# Altium project Smart Bike Theft Tracker (GPS + LoRaWAN, Ultra-Low Power).PrjPcb
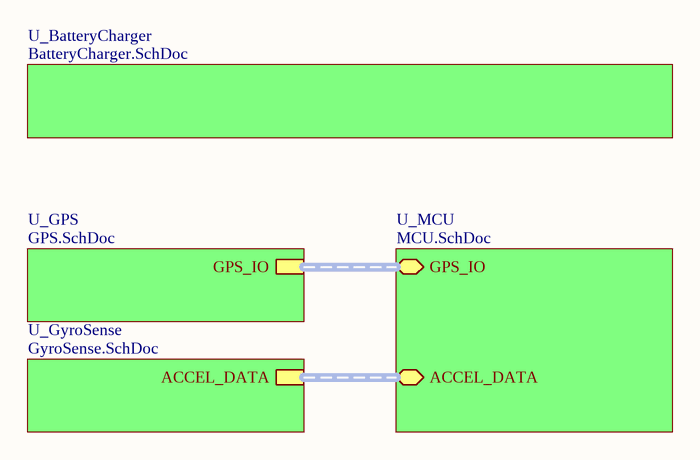
[diagram p0: Top.SchDoc]
5 sheets, 43 parts. Net scope: hierarchical (ports join the sheet entries above them; power ports are global).
Board file: Smart Bike Theft Tracker.PcbDoc
Sheets:
  Top.SchDoc
    U_GPS = GPS.SchDoc
    U_GyroSense = GyroSense.SchDoc
    U_MCU = MCU.SchDoc
    U_BatteryCharger = BatteryCharger.SchDoc

## Sheet Top.SchDoc
size A

### Sub-sheets
U_BatteryCharger = BatteryCharger.SchDoc: no entries
U_GPS = GPS.SchDoc: GPS_IO (harness GPS_IO)
U_GyroSense = GyroSense.SchDoc: ACCEL_DATA (harness ACCEL)
U_MCU = MCU.SchDoc: GPS_IO (bidir, harness GPS_IO), ACCEL_DATA (bidir, harness ACCEL)

### Buses and harness runs
harness sheet U_GPS/GPS_IO = sheet U_MCU/GPS_IO
harness sheet U_GyroSense/ACCEL_DATA = sheet U_MCU/ACCEL_DATA

## Sheet GPS.SchDoc
size A
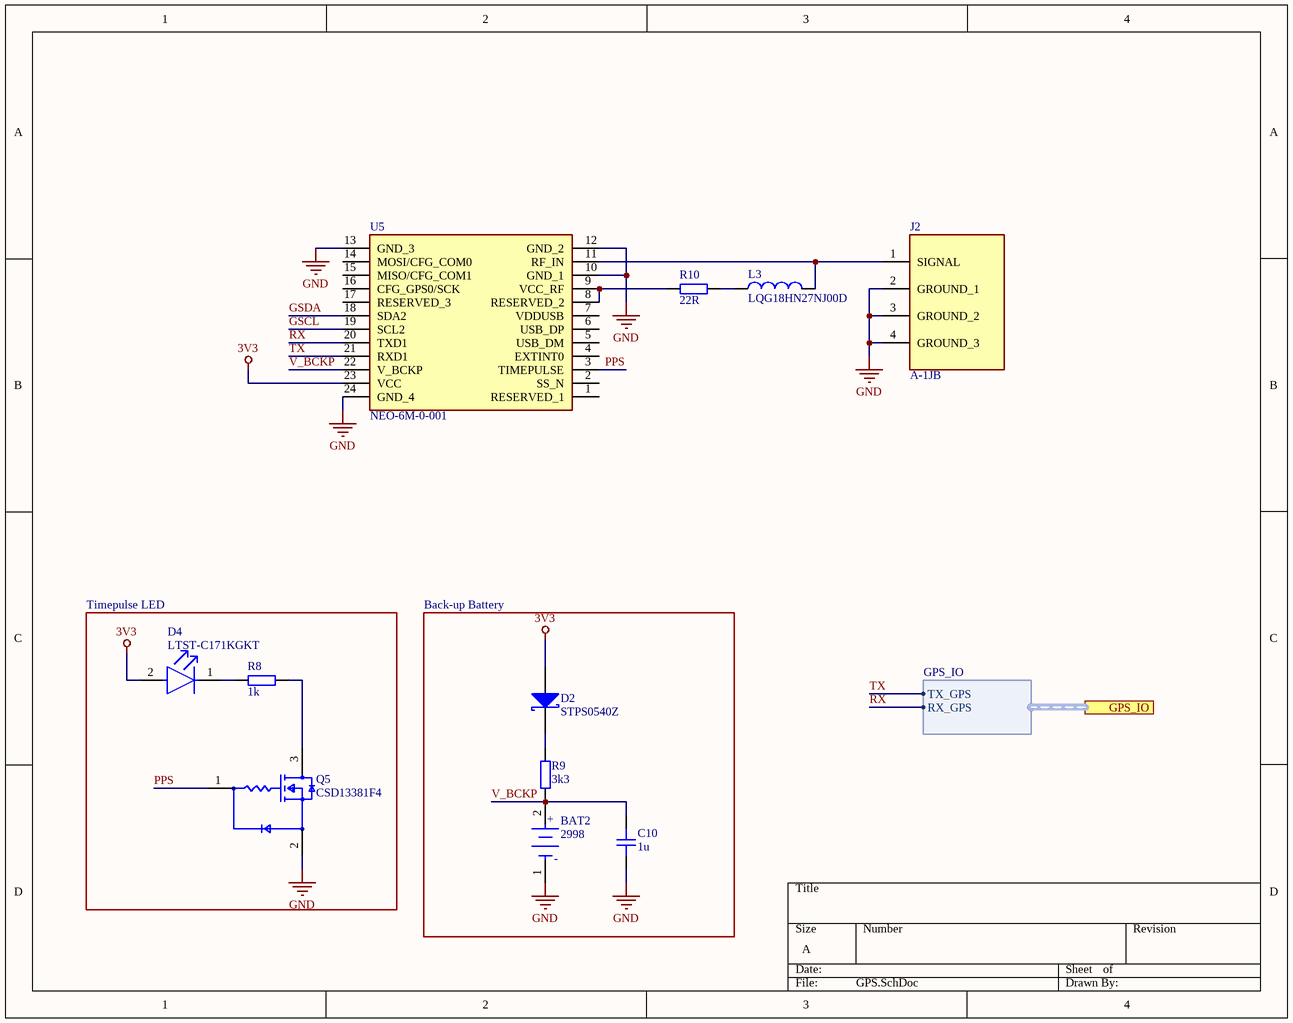
[diagram p1: GPS.SchDoc]

### Parts
BAT2  2998  [BAT_2998TR]
C10  1u  [CAP_0603]
D2  STPS0540Z  [STM-SOD-123-2_V]
D4  LTST-C171KGKT  [FP-LTST-C171KGKT-MFG]
J2  A-1JB  [A1JB]
L3  LQG18HN27NJ00D  [CAP_0603]
Q5  CSD13381F4  [FP-CSD13381F4-MFG]
R8  1k  [RES_0603]
R9  3k3  [RES_0603]
R10  22R  [RES_0603]
U5  NEO-6M-0-001  [NEO6M0001]

### Blocks framed on the sheet
Timepulse LED: D4 Q5 R8
Back-up Battery: BAT2 C10 D2 R9

### Ports
GPS_IO (harness GPS_IO)

### Harnesses
GPS_IO: TX_GPS, RX_GPS

### Nets
3V3: D2.1(A) D4.2(A) U5.23(VCC)
GND: BAT2.1(C) C10.1 J2.2(GROUND_1) J2.3(GROUND_2) J2.4(GROUND_3) Q5.2(S) U5.10(GND_1) U5.12(GND_2) U5.13(GND_3) U5.24(GND_4)
GSCL: U5.19(SCL2)
GSDA: U5.18(SDA2)
PPS: Q5.1(G) U5.3(TIMEPULSE)
RX: U5.20(TXD1) ; port GPS_IO.RX_GPS
TX: U5.21(RXD1) ; port GPS_IO.TX_GPS
V_BCKP: BAT2.2(A) C10.2 R9.1 U5.22(V_BCKP)
NetD2_2: D2.2(K) R9.2
NetD4_1: D4.1(C) R8.1
NetJ2_1: J2.1(SIGNAL) L3.2 U5.11(RF_IN)
NetL3_1: L3.1 R10.2
NetQ5_3: Q5.3(D) R8.2
NetR10_1: R10.1 U5.8(RESERVED_2) U5.9(VCC_RF)

Not connected (* = marked no-connect by the designer): U5 1(RESERVED_1) 2(SS_N) 4(EXTINT0) 5(USB_DM) 6(USB_DP) 7(VDDUSB) 14(MOSI/CFG_COM0) 15(MISO/CFG_COM1) 16(CFG_GPS0/SCK) 17(RESERVED_3)

### Notes on the sheet
- (in symbol 2998) +; -

### Library data of the parts
BAT2 = 2998: BATTERY RETAINER COIN 6.8MM SMD; Number of Batteries: 1; Package Quantity: 100; Mount: Surface Mount; Case/Package: SMD/SMT; Number of Cells: 1; REACH SVHC: No SVHC; Height: 2.9mm; Contact Material: Bronze; Material: Bronze; Lead Free: Lead Free; Termination: SMD/SMT; Color: Silver
C10 = CAP_0603: Ceramic Capacitor SMD 0603; Manufacturer: *; Manufacturer Part Number: *; Distributor Link: *; LCSC: *; Rating: *; Dielectric: *
D2 = CMP-2000-07170-1: Schottky Rectifier, 0.5 A, 40 V, 2-Pin SOP (SOD-123), RoHS, Tape and Reel; Manufacturer: STMicroelectronics; SVHC: NoSVHC(15-Jun-2015); Forward Current If(AV): 500mA; Forward Voltage VF Max: 500mV; Repetitive Reverse Voltage Vrrm Max: 40V; No. of Pins: 2Pins; Forward Surge Current Ifsm Max: 5.5A; Diode Configuration: Single; Packaging: CutTape; Datasheet Version: 01/2002; Package Reference: SOD-123-2; Package Description: 2-Pin Small Outline Diode, Body 2.7 x 1.55 mm; Manufacturer URL: http://www.st.com/; Mounting Technology: SurfaceMount; Product Range: -; Operating Temperature Max: 150°C; Diode Case Style: SOD-123; Diode Type: Schottky; Datasheet URL: http://www.st.com/content/ccc/resource/technical/document/datasheet/group1/0f/03/9b/7c/50/58/48/d7/CD00001852/files/CD00001852.pdf/jcr:content/translations/en.CD00001852.pdf
D4 = CMP-22017-000037-1: LED GREEN CLEAR SMD; Number of LEDs: 1; Viewing Angle: 130°; Lens Style: Rectangular; Dominant Wavelength: 571nm; Test Current: 20mA; Luminous Intensity: 35mcd; Power Rating: 75mW; Forward Voltage: 2.4V; Forward Current: 30mA; Reverse Voltage: 5V; Lens Color: Colorless; Wavelength: 574nm; Height: 0.8mm; Illumination Color: Green; Length: 2mm; Case/Package: 0805; Number of Pins: 2; Number of Elements: 1; Package Quantity: 1; Depth: 1.25mm; Lens Transparency: Clear; Width: 1.25mm; Color: Green; Radiation Hardening: No; Mount: Surface Mount; Packaging: Tape and Reel; Case Code (Metric): 2012; Lead Free: Lead Free; Max Operating Temperature: 85°C; Min Operating Temperature: -55°C; Case Code (Imperial): 0805; Power Dissipation: 75mW
J2 = A-1JB: U.FL (UMCC), AMC Connector Jack, Male Pin 50 Ohms Surface Mount Solder; Manufacturer_Name: Amphenol RF; Geometry.Height: 1.35mm; Manufacturer_Part_Number: A-1JB; Mouser Part Number: 523-A-1JB; Mouser Price/Stock: https://www.mouser.co.uk/ProductDetail/Amphenol-RF/A-1JB?qs=ncxkyCpAYDBidtvTkuzl1Q%3D%3D; Arrow Part Number: A-1JB; Arrow Price/Stock: https://www.arrow.com/en/products/a-1jb/amphenol-rf?utm_currency=USD&region=europe; Datasheet Link: https://s3-us-west-2.amazonaws.com/catsy.582/ca-1jb.pdf
L3 = LQG18HN27NJ00D: Ind RF Chip Multi-Layer 27nH 5% 100MHz 12Q-Factor Air 300mA 0603 Paper T/R; Package: None; Price: None; Value: *; MP: LQG18HN27NJ00D; Availability: Unavailable
Q5 = CMP-04962-000059-1: MOSFET N-CH 12V 2.1A 3PICOSTAR; Rise Time: 1.5ns; Gate to Source Voltage (Vgs): 8V; Max Power Dissipation: 500mW; Number of Elements: 1; Element Configuration: Single; Turn-Off Delay Time: 11ns; Turn-On Delay Time: 3.7ns; Drain to Source Resistance: 180mR; Input Capacitance: 200pF; Fall Time: 3.8ns; Number of Pins: 3; Drain to Source Breakdown Voltage: 12V; Package Quantity: 3000; Power Dissipation: 500mW; RoHS Compliant: Yes; Case/Package: QFN; Max Operating Temperature: 150°C; Mount: Surface Mount; Continuous Drain Current (ID): 2.1A; Drain to Source Voltage (Vdss): 12V; Number of Channels: 1; Rds On Max: 180mR; Packaging: Tape and Reel; Lead Free: Lead Free; Min Operating Temperature: -55°C
R8-R10 = RES_0603: Resistor SMD 0603; Manufacturer: *; Manufacturer Part Number: *; Distributor Link: *; LCSC: *
U5 = NEO-6M-0-001: GPS Module; Manufacturer_Name: u-blox; Geometry.Height: 2.6mm; Manufacturer_Part_Number: NEO-6M-0-001; Mouser Part Number: *; Mouser Price/Stock: *; Arrow Part Number: *; Arrow Price/Stock: *; Datasheet Link: https://www.u-blox.com/sites/default/files/products/documents/NEO-6_DataSheet_%28GPS.G6-HW-09005%29.pdf

## Sheet GyroSense.SchDoc
size A
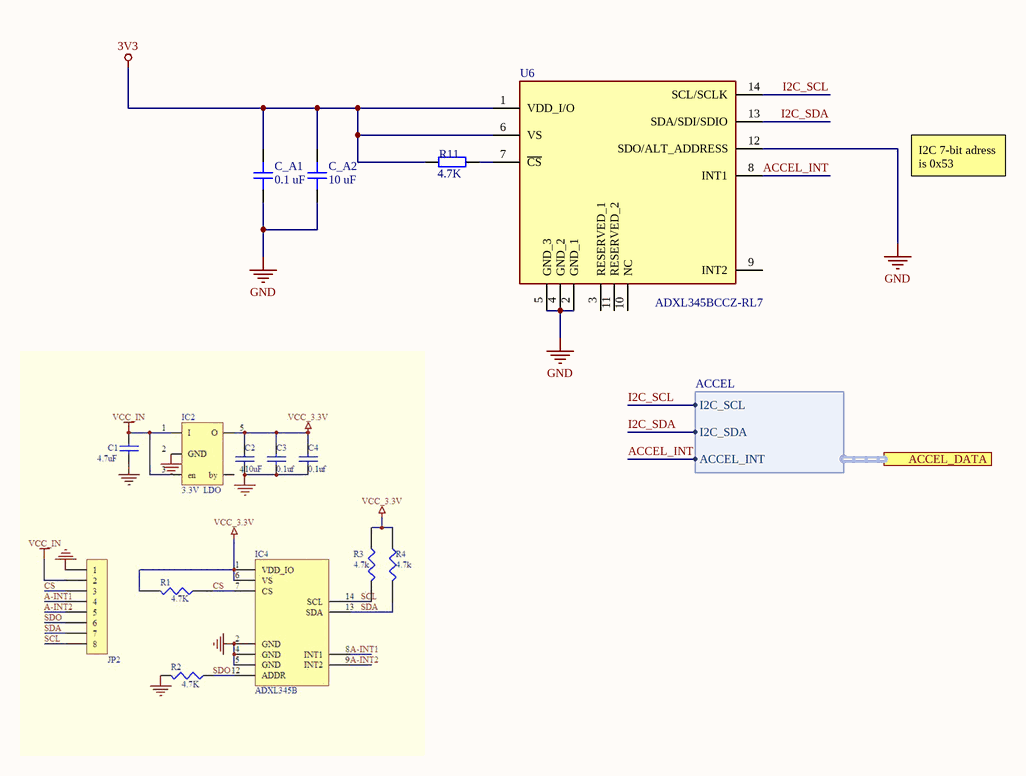
[diagram p2: GyroSense.SchDoc]

### Parts
C_A1  0.1 uF  [CAP_0603]
C_A2  10 uF  [CAP_0603]
R11  4.7K  [RES_0603]
U6  ADXL345BCCZ-RL7  [ADXL345BCCZRL7]

### Ports
ACCEL_DATA (harness ACCEL)

### Harnesses
ACCEL: I2C_SCL, ACCEL_INT, I2C_SDA

### Nets
3V3: C_A1.2 C_A2.2 R11.1 U6.1(VDD_I/O) U6.6(VS)
GND: C_A1.1 C_A2.1 U6.2(GND_1) U6.4(GND_2) U6.5(GND_3) U6.12(SDO/ALT_ADDRESS)
ACCEL_INT: U6.8(INT1) ; port ACCEL_DATA.ACCEL_INT
I2C_SCL: U6.14(SCL/SCLK) ; port ACCEL_DATA.I2C_SCL
I2C_SDA: U6.13(SDA/SDI/SDIO) ; port ACCEL_DATA.I2C_SDA
NetR11_2: R11.2 U6.7(~{CS})

Not connected (* = marked no-connect by the designer): U6 3(RESERVED_1) 9(INT2) 10(NC) 11(RESERVED_2)

### Notes on the sheet
- I2C 7-bit adress is 0x53

### Library data of the parts
C_A1 C_A2 = CAP_0603: Capacitor SMD 0603; Manufacturer: *; Manufacturer Part Number: *; Distributor Link: *; LCSC: *; Rating: *; Dielectric: *
R11 = RES_0603: Resistor SMD 0603; Manufacturer: *; Manufacturer Part Number: *; Distributor Link: *; LCSC: *
U6 = ADXL345BCCZ-RL7: ADXL345BCCZ-RL7 Analog Devices, 3-Axis Accelerometer, I2C, SPI, 14-Pin LGA 0.3 V to +3.9 V 40C to +105C; Geometry.Height: 1mm; Manufacturer_Name: Analog Devices; Manufacturer_Part_Number: ADXL345BCCZ-RL7; Mouser Part Number: 584-ADXL345BCCZ-R7; Mouser Price/Stock: https://www.mouser.co.uk/ProductDetail/Analog-Devices/ADXL345BCCZ-RL7?qs=WIvQP4zGaninp9Gc%252BCsJzQ%3D%3D; Arrow Part Number: ADXL345BCCZ-RL7; Arrow Price/Stock: https://www.arrow.com/en/products/adxl345bccz-rl7/analog-devices?utm_currency=USD&region=nac; Datasheet Link: https://www.analog.com/media/en/technical-documentation/data-sheets/adxl345.pdf

## Sheet MCU.SchDoc
size A4
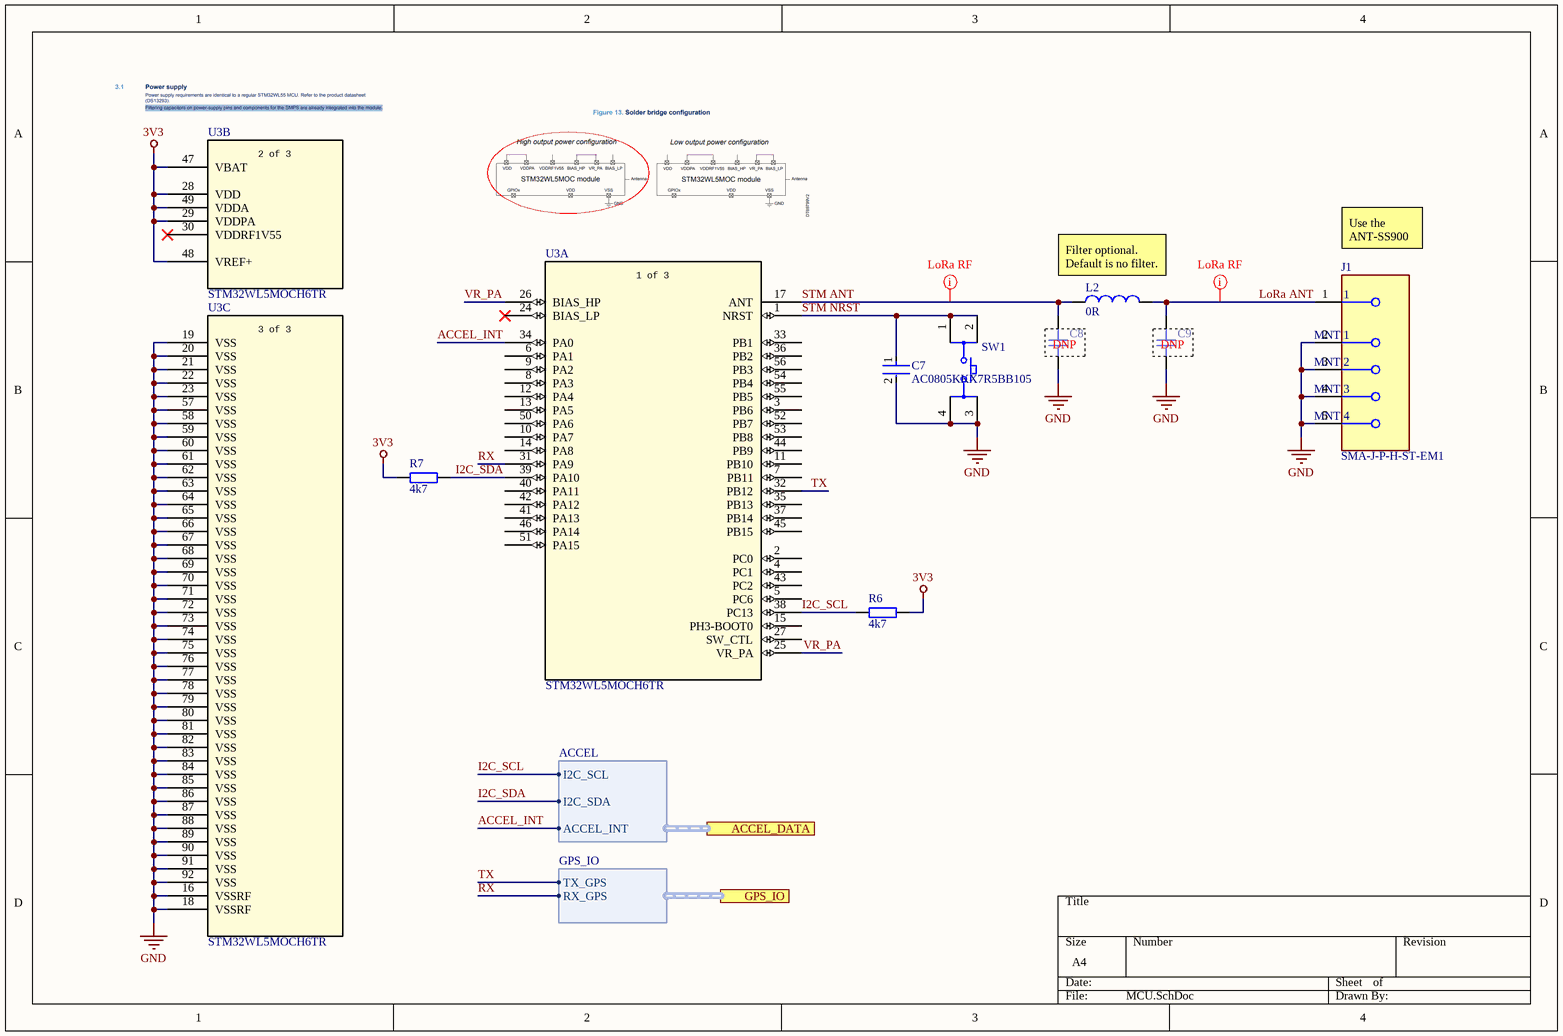
[diagram p3: MCU.SchDoc]

### Parts
C7  AC0805KKX7R5BB105  [FP-AC0805-0_85-MFG]
C8  (no value)  [CAP_0603]
C9  (no value)  [CAP_0603]
J1  SMA-J-P-H-ST-EM1  [FP-SMA-J-P-H-ST-EM1-MFG]
L2  0R  [CAP_0603]
R6  4k7  [RES_0603]
R7  4k7  [RES_0603]
SW1  TL3301AF160QG  [FP-TL3301AF160QG-MFG]  (value not drawn)
U3  STM32WL5MOCH6TR  [LGA-92_10X10_STM]  (parts A,B,C of 3)

### Ports
ACCEL_DATA (harness ACCEL), GPS_IO (harness GPS_IO)

### Harnesses
ACCEL: I2C_SCL, ACCEL_INT, I2C_SDA
GPS_IO: TX_GPS, RX_GPS

### Nets
3V3: R6.2 R7.2 U3.28(VDD) U3.29(VDDPA) U3.47(VBAT) U3.48(VREF+) U3.49(VDDA)
GND: C7.2 C8.1 C9.1 J1.2(MNT_1) J1.3(MNT_2) J1.4(MNT_3) J1.5(MNT_4) SW1.3 SW1.4 U3.16(VSSRF) U3.18(VSSRF) U3.19(VSS) U3.20(VSS) U3.21(VSS) U3.22(VSS) U3.23(VSS) U3.57(VSS) U3.58(VSS) U3.59(VSS) U3.60(VSS) U3.61(VSS) U3.62(VSS) U3.63(VSS) U3.64(VSS) U3.65(VSS) U3.66(VSS) U3.67(VSS) U3.68(VSS) U3.69(VSS) U3.70(VSS) U3.71(VSS) U3.72(VSS) U3.73(VSS) U3.74(VSS) U3.75(VSS) U3.76(VSS) U3.77(VSS) U3.78(VSS) U3.79(VSS) U3.80(VSS) U3.81(VSS) U3.82(VSS) U3.83(VSS) U3.84(VSS) U3.85(VSS) U3.86(VSS) U3.87(VSS) U3.88(VSS) U3.89(VSS) U3.90(VSS) U3.91(VSS) U3.92(VSS)
ACCEL_INT: U3.34(PA0) ; port ACCEL_DATA.ACCEL_INT
I2C_SCL: R6.1 U3.38(PC13) ; port ACCEL_DATA.I2C_SCL
I2C_SDA: R7.1 U3.39(PA10) ; port ACCEL_DATA.I2C_SDA
LoRa ANT: C9.2 J1.1 L2.2
RX: U3.31(PA9) ; port GPS_IO.RX_GPS
STM ANT: C8.2 L2.1 U3.17(ANT)
STM NRST: C7.1 SW1.1 SW1.2 U3.1(NRST)
TX: U3.32(PB12) ; port GPS_IO.TX_GPS
VR_PA: U3.25(VR_PA) U3.26(BIAS_HP)

Not connected (* = marked no-connect by the designer): U3 2(PC0) 3(PB6) 4(PC1) 5(PC6) 6(PA1) 7(PB11) 8(PA3) 9(PA2) 10(PA7) 11(PB10) 12(PA4) 13(PA5) 14(PA8) 15(PH3-BOOT0) 24(BIAS_LP)* 27(SW_CTL) 30(VDDRF1V55)* 33(PB1) 35(PB13) 36(PB2) 37(PB14) 40(PA11) 41(PA13) 42(PA12) 43(PC2) 44(PB9) 45(PB15) 46(PA14) 50(PA6) 51(PA15) 52(PB7) 53(PB8) 54(PB4) 55(PB5) 56(PB3)

### Layout directives
net class LoRa RF: LoRa ANT, STM ANT

### Notes on the sheet
- Use the ANT-SS900
- (near L2) Filter optional.
  Default is no filter.
- (near C8) DNP
- (near C9) DNP
- (in symbol STM32WL5MOCH6TR, part A) 1 of 3
- (in symbol STM32WL5MOCH6TR, part B) 2 of 3
- (in symbol STM32WL5MOCH6TR, part C) 3 of 3

### Library data of the parts
C7 = CMP-03422-000426-1: AC0805 1 uF X7R 10.00% 6.3 V; Manufacturer: Yageo; Material: Ceramic; Temperature Coefficient: 15%; Value: 1 uF; Tolerance: 0.1; Automotive Grade: Grade 1; Voltage Rating: 6.3 V; Temperature Characteristic: X7R; Device Class L3: Ceramic Capacitors; RoHS: TRUE; ComponentLink2Description: Datasheet; Device Class L2: Capacitors; Temperature Range Low: -55°C; Temperature: -55°C to +125°C; Temperature Range High: +125°C; ComponentLink2URL: http://www.yageo.com/documents/recent/UPY-AC_NP0X7R_16V-to-630V_12.pdf; Device Class L1: Passive Components; Footprint Url: http://www.yageo.com/exep/pages/download/literatures/UPY-C_GEN_24.pdf; Height: 0.95mm; Manufacturer Part Number: AC0805KKX7R5BB105; Octopart: https://octopart.com/ac0805kkx7r5bb105-yageo-78873385; Package: AC0805-0.85; Ipc Land Pattern Name: CAPC200125X85; Automotive: Yes; Category: Cap; Lead Free: Yes; Capacitance: 1 uF
C8 C9 = CAP_0603: Capacitor SMD 0603 / Ceramic; Manufacturer: *; Manufacturer Part Number: *; Distributor Link: *; LCSC: *; Rating: *; Dielectric: *
J1 = LoRa antenna connector: CONN SMA JACK STR 50OHM EDGE MNT / Use the ANT-SS900; Dielectric Material: PTFE; Center Contact Plating: Gold; Max Frequency: 6GHz; Body Material: Brass; Voltage Rating: 335V; Impedance: 50R; Package Quantity: 1; Case/Package: SMA; Max Operating Temperature: 125°C; Fastening Type: Threaded; Orientation: Straight; Depth: 13.33mm; RoHS Compliant: Yes; Length: 6.35mm; Insulation Material: Polytetrafluoroethylene; Termination: Solder; Min Operating Temperature: -65°C; Housing Color: Gold; Contact Plating: Gold; Contact Material: Copper; Connector Type: SMA; Mount: Edge; Series: SMA; Packaging: Tray; Body Plating: Gold; Radiation Hardening: No
L2 = Inductor: Not necessary. Place 0 ohm resistor; MP: LQG18HN27NJ00D; Package: None; Price: None; Value: *; Availability: Unavailable
R6 R7 = RES_0603: Resistor SMD 0603; Manufacturer: *; Manufacturer Part Number: *; Distributor Link: *; LCSC: *
SW1 = CMP-17879-000012-1: SWITCH TACTILE SPST-NO 0.05A 12V; Actuator Type: Standard; Current Rating: 50mA; Contact Resistance: 100mR; Max Voltage Rating (DC): 50V; Actuator Length: 1.4mm; Electrical Life: 100000Cycles; Throw Configuration: SPST; Switch Travel: 0.25mm; Operating Force: 160gf; Switch Function: Off-Mom; Actuator Material: Nylon; Illumination Type: Non-Illuminated; Orientation: Straight; Lead Free: Lead Free; Contact Material: Silver; Series: TL3301; Mount: Surface Mount; Voltage Rating: 50V; REACH SVHC: No SVHC; Voltage Rating (DC): 12V; Packaging: Tape and Reel; Termination: Gull Wing; RoHS Compliant: Yes; Min Operating Temperature: -20°C; Package Quantity: 1000; Mechanical Life: 100000Cycles; Contact Plating: Silver; Max Operating Temperature: 70°C; Insulation Resistance: 100MR
U3 = STM32WL5MOCH6TR: Multiprotocol LPWAN dual-core module 32-bit Arm Cortex-M4/M0+ LoRa,(G)FSK, (G)MSK, BPSK; Manufacturer_Name: STMicroelectronics; Copyright: Copyright (C) 2026 Ultra Librarian. All rights reserved.; Manufacturer_Part_Number: STM32WL5MOCH6TR; Datasheet: https://www.st.com/resource/en/datasheet/stm32wl5moc.pdf; RefDes: RefDes; Type: Type

## Sheet BatteryCharger.SchDoc
size A4
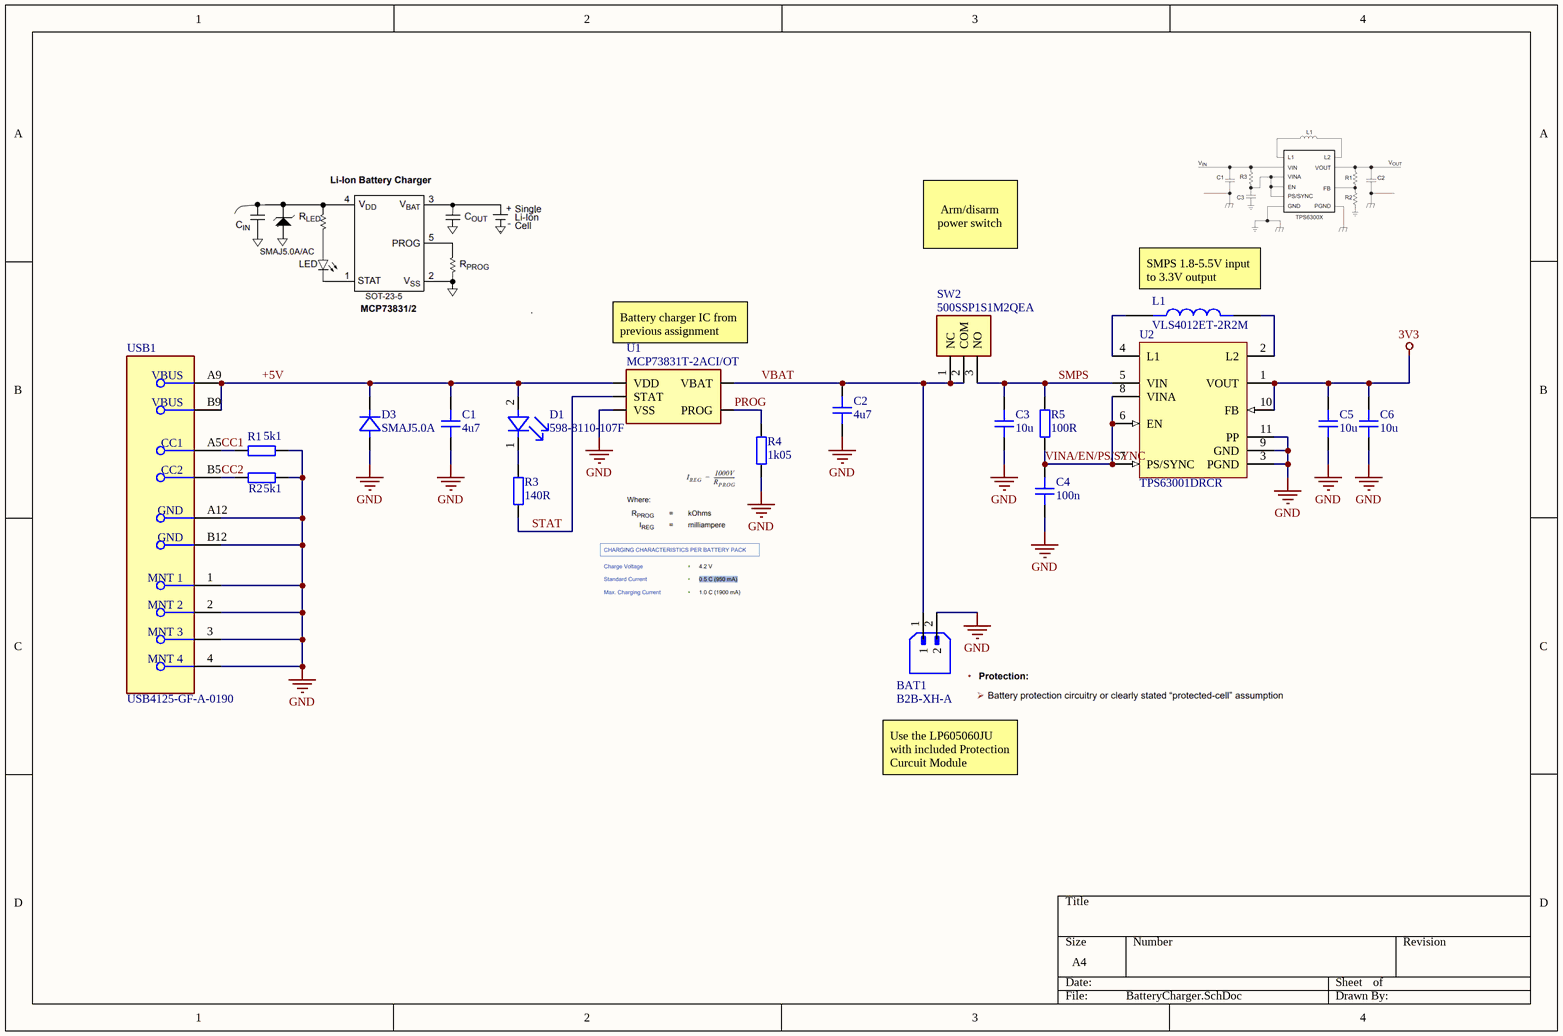
[diagram p4: BatteryCharger.SchDoc]

### Parts
BAT1  B2B-XH-A  [JST_B2B-XH-A]
C1  4u7  [CAP_0603]
C2  4u7  [CAP_0603]
C3  10u  [CAP_0603]
C4  100n  [CAP_0603]
C5  10u  [CAP_0603]
C6  10u  [CAP_0603]
D1  598-8110-107F  [RED_LED_0805]
D3  SMAJ5.0A  [SMASeries_LTF-M]
L1  VLS4012ET-2R2M  [IND_VLS4012ET-2R2M]
R1  5k1  [RES_0603]
R2  5k1  [RES_0603]
R3  140R  [RES_0603]
R4  1k05  [RES_0603]
R5  100R  [RES_0603]
SW2  500SSP1S1M2QEA  [500SSP1S1M2QEA]
U1  MCP73831T-2ACI/OT  [SOT95P270X145-5N]
U2  TPS63001DRCR  [DRC0010J_V]
USB1  USB4125-GF-A-0190  [FP-USB4125-GF-A-0190-MFG]

### Nets
3V3: C5.2 C6.2 U2.1(VOUT) U2.10(FB)
GND: BAT1.2 C1.1 C2.1 C3.1 C4.1 C5.1 C6.1 D3.2 R1.1 R2.2 R4.2 U1.2(VSS) U2.3(PGND) U2.9(GND) U2.11(PP) USB1.1(MNT_1) USB1.2(MNT_2) USB1.3(MNT_3) USB1.4(MNT_4) USB1.A12(GND) USB1.B12(GND)
+5V: C1.2 D1.2(A) D3.1 U1.4(VDD) USB1.A9(VBUS) USB1.B9(VBUS)
CC1: R1.2 USB1.A5(CC1)
CC2: R2.1 USB1.B5(CC2)
PROG: R4.1 U1.5(PROG)
SMPS: C3.2 R5.2 SW2.3(NO) U2.5(VIN)
STAT: R3.1 U1.1(STAT)
VBAT: BAT1.1 C2.2 SW2.1(NC) SW2.2(COM) U1.3(VBAT)
VINA/EN/PS/SYNC: C4.2 R5.1 U2.6(EN) U2.7(PS/SYNC) U2.8(VINA)
NetD1_1: D1.1(C) R3.2
NetL1_1: L1.1 U2.4(L1)
NetL1_2: L1.2 U2.2(L2)

### Notes on the sheet
- Arm/disarm power switch
- (near L1) SMPS 1.8-5.5V input to 3.3V output
- (near U1) Battery charger IC from previous assignment
- Use the LP605060JU with included Protection Curcuit Module

### Library data of the parts
BAT1 = B2B-XH-A: MF: {'manufacturer': u'JST Sales America Inc.'}; Package: None; Price: None; Value: *; MP: B2B-XH-A; Availability: Unavailable
C1-C6 = CAP_0603: Capacitor SMD 0603 / Ceramic; Manufacturer: *; Manufacturer Part Number: *; Distributor Link: *; LCSC: *; Rating: *; Dielectric: *
D1 = RED_LED_0805: 598-8110-107F 598-8110-107F, Dialight, SMD LED 0805 Package, Red Single color SOLD IN INCREMENTS OF 4000. (REEL); NexarPartId: 868569; Wavelength: 635nm; Forward Current: 20mA; Lens Style: Clear; Forward Voltage: 2.2V; Power Dissipation: 60mW; Max Junction Temperature (Tj): 105°C; Luminous Intensity: 40mcd; Viewing Angle: 140°; Reverse Voltage: 5V; Number of LEDs: 1; Number of Pins: 2; Schedule B: 8541402000, 8541402000|8541402000, 8541402000|8541402000|8541402000, 8541402000|8541402000|8541402000|8541402000; Length: 2mm; Width: 1.25mm; Mount: Surface Mount; Height: 800µm; Case Code (Imperial): 0805; Case Code (Metric): 2012; RoHS: Compliant; Min Operating Temperature: -30°C; Color: Red; Case/Package: 0805; Depth: 1.25mm; Lead Free: Lead Free; Max Operating Temperature: 85°C; Test Current: 20mA; Illumination Color: Red; Number of Elements: 1; Dominant Wavelength: 635nm; REACH SVHC: No SVHC; Radiation Hardening: No
D3 = SMAJ5.0A: ESD Protection Diode; Manufacturer_Name: Littelfuse Inc; Copyright: Copyright (C) 2025 Ultra Librarian. All rights reserved.; Manufacturer_Part_Number: SMAJ5.0A
L1 = VLS4012ET-2R2M: INDUCTOR, 2.2UH, 2.2A, 20%, SMD; Product Range:TDK - VLS-E Series; Inductance:2.2ÂµH; Inductance Tolerance:Â± 20%; Inductor Construction:Shielded; DC Resistance Max:0.081ohm; RMS Current (Irms):2.2A; Saturation Current (Isat):1.9A; Case Dimensions:4mm x 4mm x 1.2mm; SVHC:No SVHC (20-Jun-2013); MF: TDK; Package: NON STANDARD-2 TDK; SnapEDA_Link: https://www.snapeda.com/parts/VLS4012ET-2R2M/TDK/view-part/?ref=snap; Value: *; MP: VLS4012ET-2R2M; Purchase-URL: https://pricing.snapeda.com/search/part/VLS4012ET-2R2M/?ref=eda; Check_prices: https://www.snapeda.com/parts/VLS4012ET-2R2M/TDK/view-part/?ref=eda; Availability: In Stock; Price: None
R1-R5 = RES_0603: Resistor SMD 0603; Manufacturer: *; Manufacturer Part Number: *; Distributor Link: *; LCSC: *
SW2 = 500SSP1S1M2QEA: SLIDE, 5A, 120VAC/28VDC SPDT, On-On Through Hole; Manufacturer_Name: E-Switch; Geometry.Height: 11.43mm; Manufacturer_Part_Number: 500SSP1S1M2QEA; Mouser Part Number: 612-500-A121; Mouser Price/Stock: https://www.mouser.co.uk/ProductDetail/E-Switch/500SSP1S1M2QEA?qs=rR7wk9eDIwofjM3j2mZRnA%3D%3D; Arrow Part Number: *; Arrow Price/Stock: *; Datasheet Link: https://configured-product-images.s3.amazonaws.com/2D/specs/500SSP1S1M2QEA.pdf
U1 = MCP73831T-2ACI/OT: Li-Ion Charge Controller 4.2V SOT23-5; Manufacturer_Name: Microchip; Geometry.Height: 1.45mm; Mouser Part Number: 579-MCP73831T-2ACIOT; Mouser Price/Stock: https://www.mouser.co.uk/ProductDetail/Microchip-Technology/MCP73831T-2ACI-OT?qs=yUQqVecv4qvbBQBGbHx0Mw%3D%3D; Manufacturer_Part_Number: MCP73831T-2ACI/OT; Datasheet Link: http://ww1.microchip.com/downloads/en/DeviceDoc/20001984g.pdf
U2 = CMP-0345-00006-2: Buck-Boost Voltage Converter with 1.8 to 5.5 V Input and 3.3 V Output, -40 to 85 degC, 10-Pin SON (DRC), Green (RoHS & no Sb/Br); Manufacturer: Texas Instruments; Synchronous Rectification: TRUE; Iq(Typ)(mA): 0.03; Regulated Outputs(#): 1; Preset Vout(V): 3.3; Vin(Min)(V): 1.8; Switching Frequency(Max)(kHz): 1500; Iout(Max)(A): 1.2; SubFamily: Buck-Boost Regulator; Vin(Max)(V): 5.5; PartNumber: TPS63001DRCR; Topology: Buck-Boost; Dynamic Voltage Scaling: TRUE; PackageVersion: revL, Sep-2011; ComponentLink2Description: Package Specification; DatasheetVersion: SLVS520B; Eco-Plan: Green (RoHS & no Sb/Br); ComponentLink1URL: http://www.ti.com/general/docs/lit/getliterature.tsp?genericPartNumber=TPS63001&fileType=pdf; Mounting Technology: Surface Mount; Vout(Min)(V): 3.3; ComponentLink2URL: http://www.ti.com/litv/pdf/mpds117k; PackageDescription: 10-Pin Plastic Small Outline No-Lead, 3 x 3 x 1 mm Body, 0.5 mm Pitch, Exposed Pad; PackageReference: DRC0010J; Vout(Max)(V): 3.3; ComponentLink1Description: Datasheet
USB1 = USB type-C: CONN RCPT TYPE C 6P SMD RA

## Nets that join several sheets
3V3: GPS (D2.1 D4.2 U5.23), GyroSense (5 pins), MCU (7 pins), BatteryCharger (C5.2 C6.2 U2.1 U2.10)
GND: GPS (10 pins), GyroSense (6 pins), MCU (52 pins), BatteryCharger (21 pins)
ACCEL_INT: GyroSense (U6.8), MCU (U3.34)
I2C_SCL: GyroSense (U6.14), MCU (R6.1 U3.38)
I2C_SDA: GyroSense (U6.13), MCU (R7.1 U3.39)
RX: GPS (U5.20), MCU (U3.31)
TX: GPS (U5.21), MCU (U3.32)